# EAGLE design dimmer230 (EAGLE 4.16)
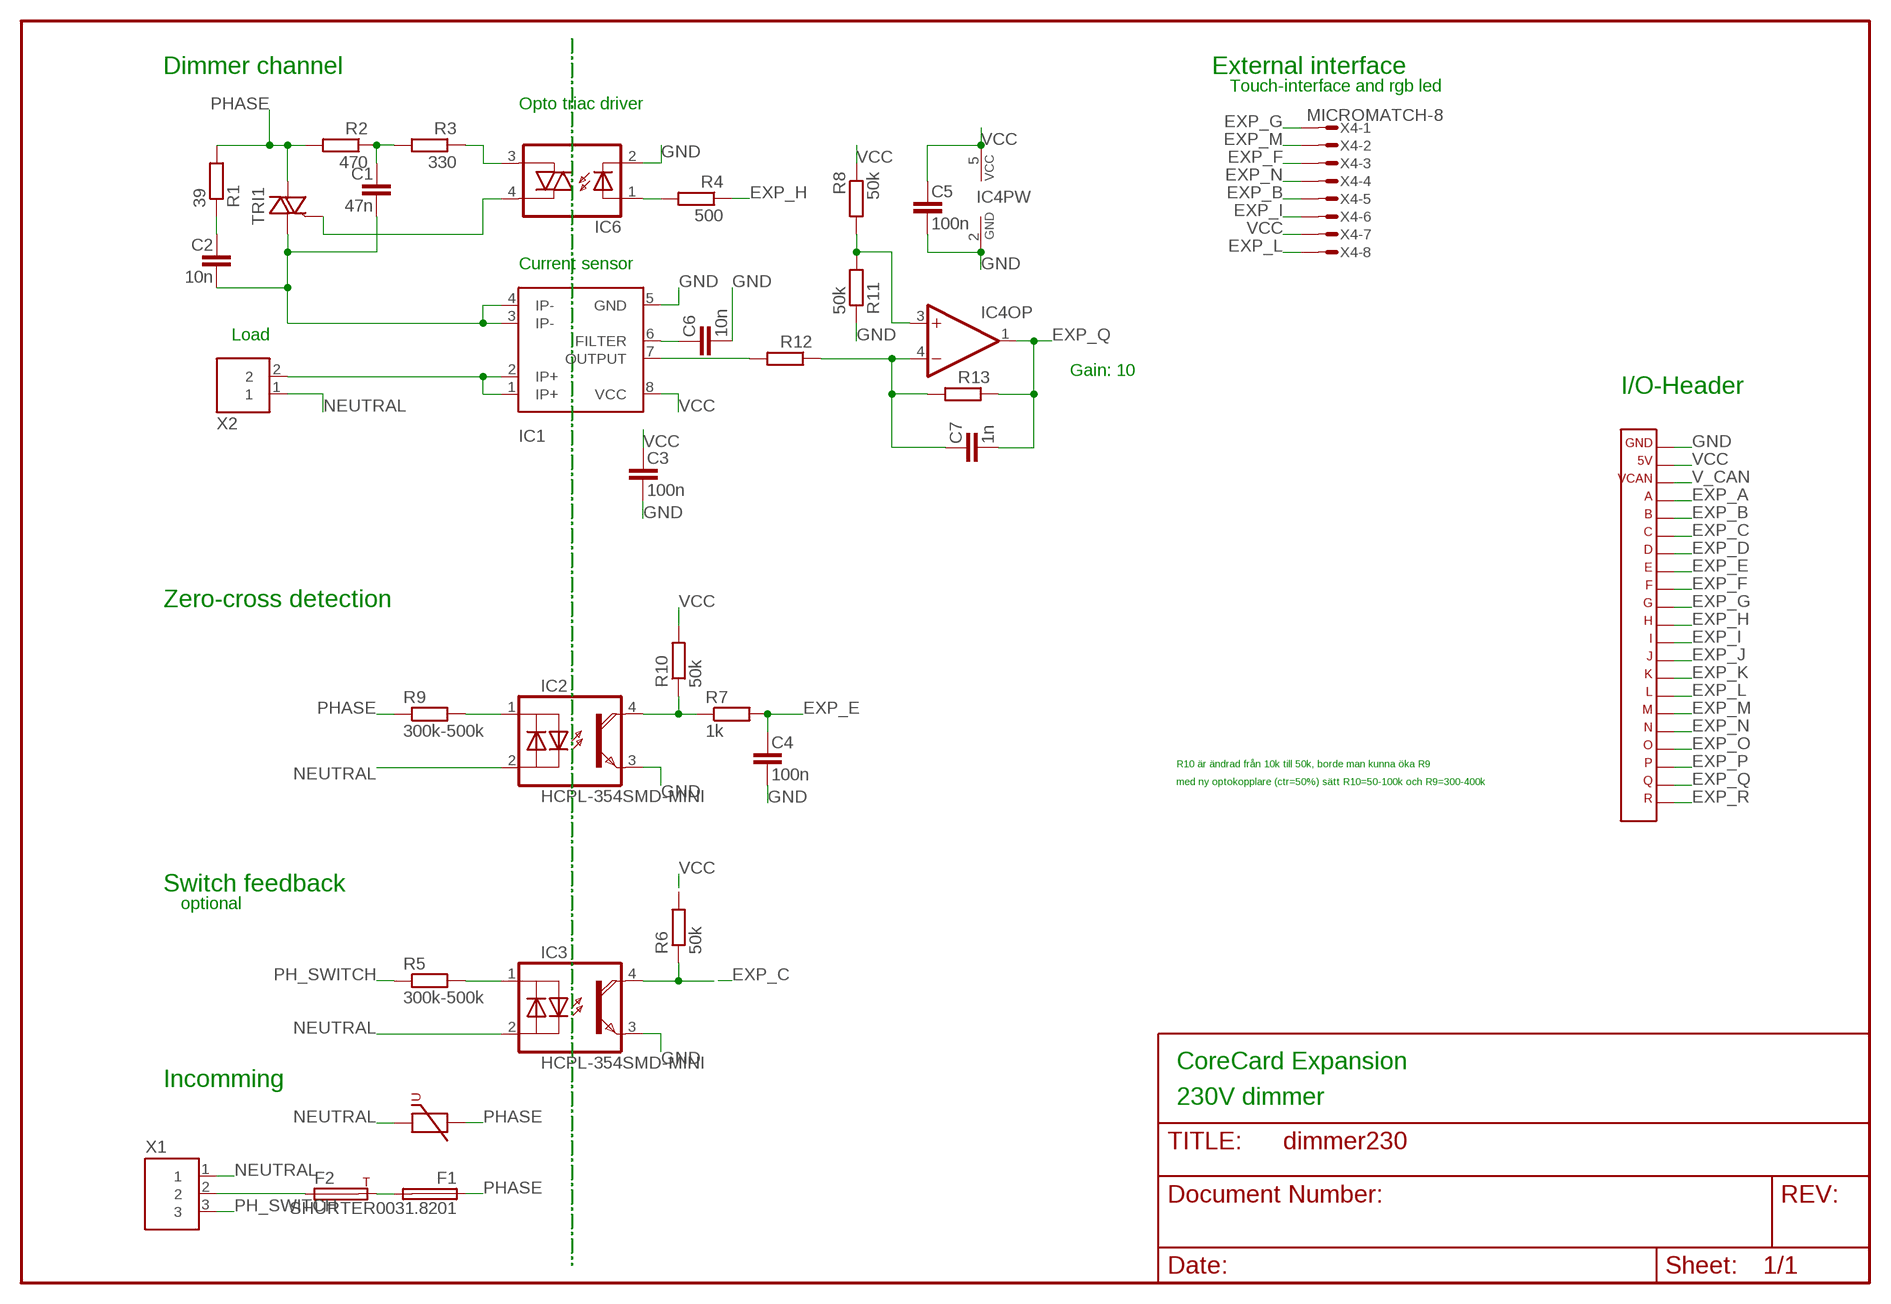
[diagram p0: schematic, sheet 1]

## Parts
C1  47n  C-EUC102-04313  [C102-04313]
C2  10n  C-EUC102-04313  [C102-04313]
C3  100n  C-EUC0603  [C0603]
C4  100n  C-EUC0603  [C0603]
C5  100n  C-EUC0603  [C0603]
C6  10n  C-EUC0603  [C0603]
C7  1n  C-EUC0603  [C0603]
F1  SHURTER0031.8201  [22.5]
F2  G4APHT  [PHT]
IC1  ACS712SOIC  [SOIC]
IC2  HCPL-354SMD-MINI  [SMD-MINI]
IC3  HCPL-354SMD-MINI  [SMD-MINI]
IC4  NCS2001SQ2T2SOT23-5  [SOT23-5]
IC6  S2S3ADYFSMD  [SMD]
R1  39  R-EUR1206  [R1206]
R2  470  R-EUR1206  [R1206]
R3  330  R-EUR1206  [R1206]
R4  500  R-EUR0603  [R0603]
R5  300k-500k  R-EUR1206  [R1206]
R6  50k  R-EUR0603  [R0603]
R7  1k  R-EUR0603  [R0603]
R8  50k  R-EUR0603  [R0603]
R9  300k-500k  R-EUR1206  [R1206]
R10  50k  R-EUR0603  [R0603]
R11  50k  R-EUR0603  [R0603]
R12  R-EUR0603  [R0603]
R13  R-EUR0603  [R0603]
TRI1  BTA204SDPAK  [DPAK]
V1  VC32SMD  [SMD]
X1  BLOCK35.08  [PCB3_5.08]
X2  BLOCK25.08  [PCB2_5.08]
X3  CORE_IOHEADEXP  [CORE_IOHEAD_NOSILC]
X4  MICROMATCH-8  [MICROMATCH-8]

## Nets
CUR_DIV: IC4.3(OP:+IN) R8.2 R11.2
CUR_OUTP: IC1.7(OUTPUT) R12.2
EXP_A: X3.4
EXP_B: X3.5 X4.5
EXP_C: IC3.4(COL) R6.1 X3.6
EXP_D: X3.7
EXP_E: C4.1 R7.2 X3.8
EXP_F: X3.9 X4.3
EXP_G: X3.10 X4.1
EXP_H: R4.1 X3.11
EXP_I: X3.12 X4.6
EXP_J: X3.13
EXP_K: X3.14
EXP_L: X3.15 X4.8
EXP_M: X3.16 X4.2
EXP_N: X3.17 X4.4
EXP_O: X3.18
EXP_P: X3.19
EXP_Q: C7.2 IC4.1(OP:OUT) R13.1 X3.20
EXP_R: X3.21
FILT: C6.1 IC1.6(FILTER)
GATE1: IC6.4(A2) TRI1.3(G)
GND: C3.2 C4.2 C5.2 C6.2 IC1.5(GND) IC2.3(E) IC3.3(E) IC4.2(PW:GND) IC6.2(C) R11.1 X3.1
IP+: IC1.1(IP+) IC1.2(IP+) X2.2
IP-: C1.2 C2.2 IC1.3(IP-) IC1.4(IP-) TRI1.1(T1)
N$1: IC6.3(A1) R3.1
N$2: C1.1 R2.1 R3.2
N$3: IC2.1(A) R9.2
N$4: IC6.1(A) R4.2
N$5: IC2.4(COL) R7.1 R10.1
N$7: C2.1 R1.1
N$9: IC3.1(A) R5.2
NEUTRAL: IC2.2(C) IC3.2(C) V1.P$1 X1.1 X2.1
OP_NEG: C7.1 IC4.4(OP:-IN) R12.1 R13.2
PH_SWITCH: R5.1 X1.3
PHASE: F1.P$1 R1.2 R2.2 R9.1 TRI1.MB(T2) V1.P$2
THERMAL_FUSED: F1.P$2 F2.P$2
UNFUSED_PHASE: F2.P$1 X1.2
V_CAN: X3.3
VCC: C3.1 C5.1 IC1.8(VCC) IC4.5(PW:VCC) R6.2 R8.1 R10.2 X3.2 X4.7

## Notes on the sheet
- Dimmer channel | External interface
- Touch-interface and rgb led
- Opto triac driver
- Current sensor
- Load
- Gain: 10
- I/O-Header
- Zero-cross detection
- R10 är ändrad från 10k till 50k, borde man kunna öka R9
- med ny optokopplare (ctr=50%) sätt R10=50-100k och R9=300-400k
- Switch feedback
- optional
- CoreCard Expansion
- Incomming
- 230V dimmer

## Library data of the parts
C1-C7 = rcl:C-EU
F1 = fuseholder_schurter:SHURTER0031.8201
F2 = thermofuse-g4a:G4A
IC1 = ACS712:ACS712
IC2 IC3 = optocoupler_hcpl-354:HCPL-354
IC4 = NCS2001:NCS2001SQ2T2
IC6 = optocoupler-S2S3ADYF:S2S3ADYF
R1-R13 = rcl:R-EU
TRI1 = triac:BTA204S
V1 = varistor_VC32:VC32
X1 = terminal_block:BLOCK3
X2 = terminal_block:BLOCK2
X3 = expboard:CORE_IOHEAD: CoreCard IO-header for expansion cards
X4 = con-amp-micromatch:MICROMATCH-8: MicroMaTch 8 7-215464-8 / 0-215464-8 Drawing Number C-215464 DDEController.pdf

## Board
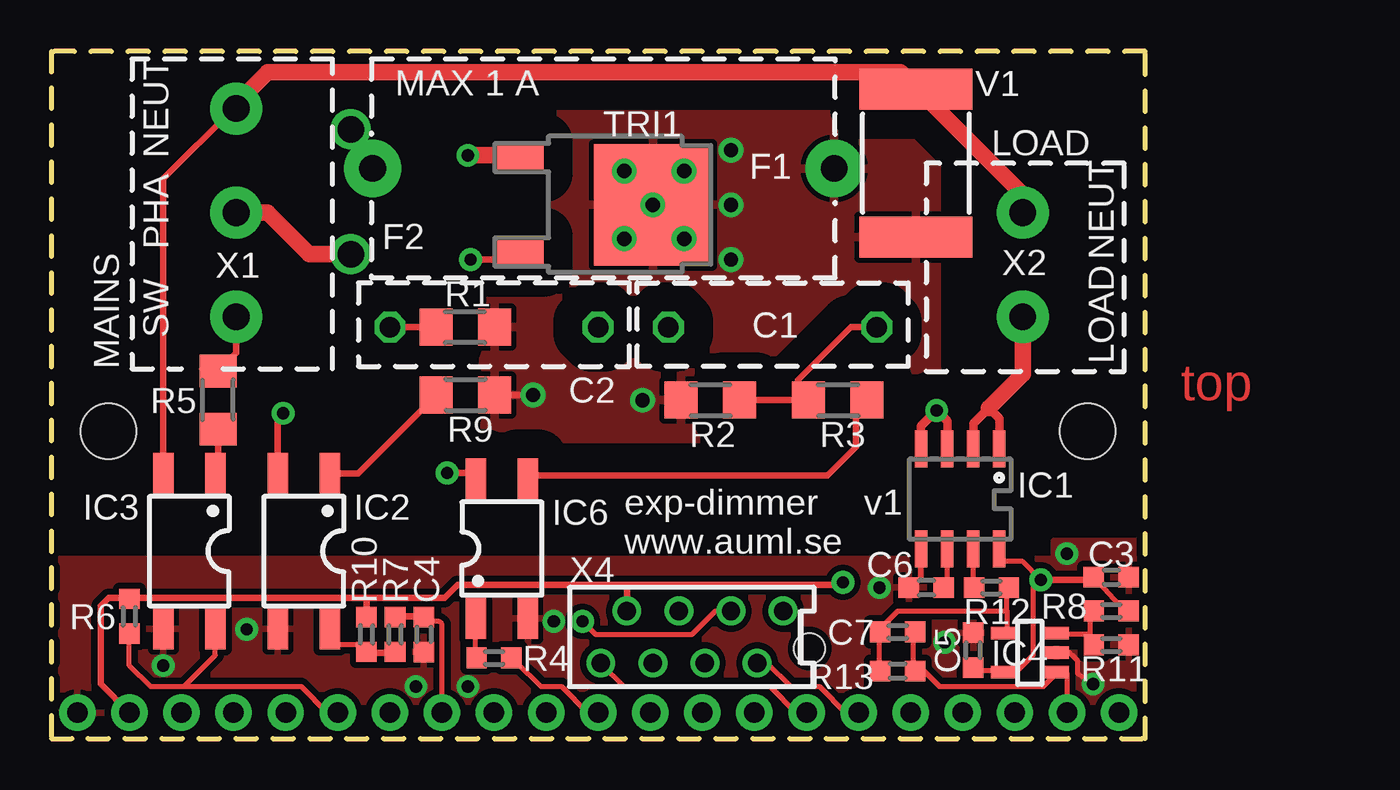
[diagram p1: board, top side]
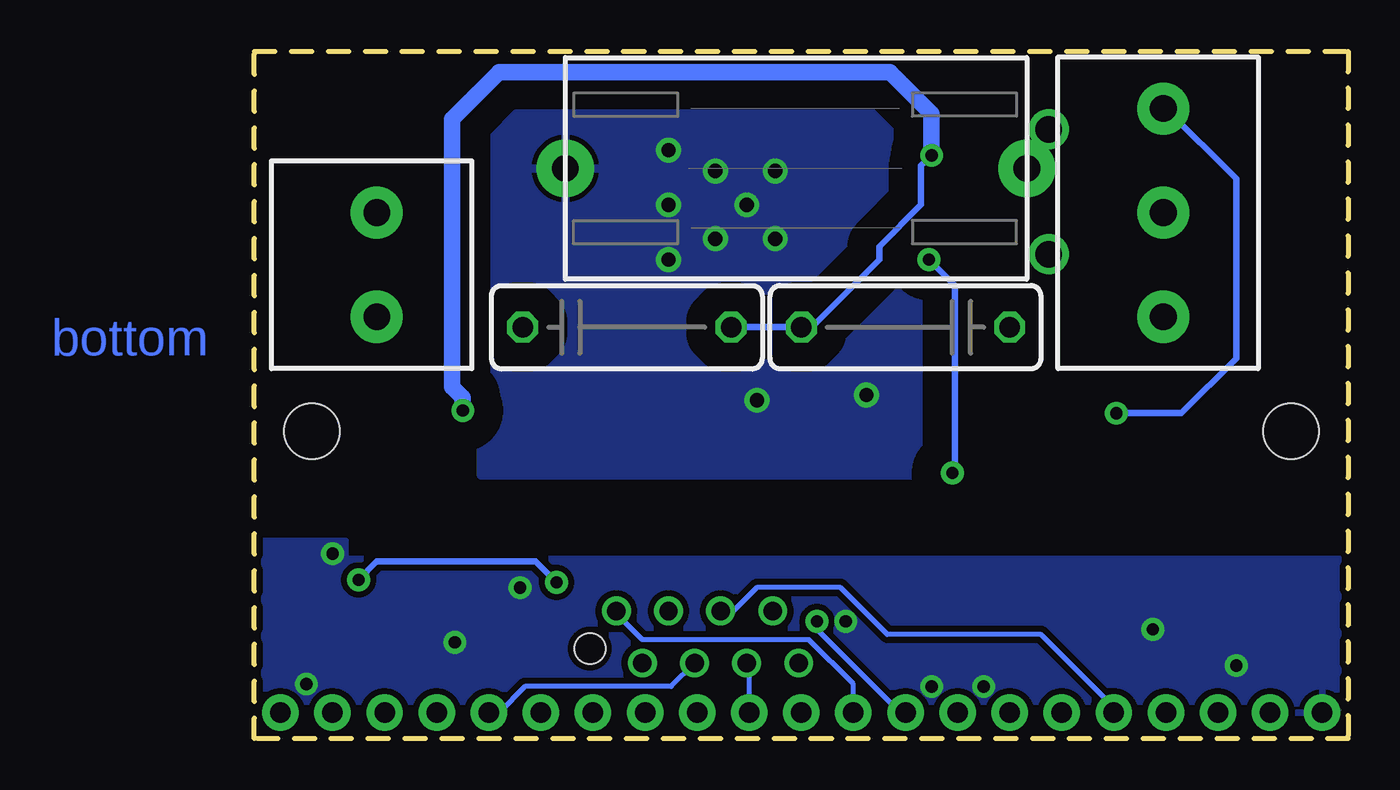
[diagram p2: board, bottom side, seen from below]

Size 53.34 x 33.53 mm. Coordinates in mm from the lower left corner, seen from the top.
Outline: 0,0 53.34,0 53.34,33.53 0,33.53 0,0
Copper layers (1*16): Top 0.035mm / dielectric 1.5mm / Bottom 0.035mm
Design rules "default": minimum track width 10mil, minimum drill 0.6mm, track to track 10mil, track to pad 10mil, pad to pad 10mil, via to via 10mil, smd to smd 8mil, copper to edge 10mil, drill to drill 8mil, minimum pad ring 10mil, minimum via ring 10mil, stop-mask expansion 4mil, vias tented up to drill 0mil, thermal gap 10mil
Holes 2.7 mm at 50.55,14.99 2.79,14.99

### Footprints (pad centres in the part's own frame; a part is rotated, then mirrored left to right if it is on the bottom)
C102-04313 = drill 1 octagon: 1 -5.08,0; 2 5.08,0
C0603 = smd 1 x 1: 1 -0.85,0; 2 0.85,0
22.5 = drill 1.3 pad 2.794 round: P$1 11.25,0; P$2 -11.25,0
PHT = drill 1.3 round: P$1 0,-3.048; P$2 0,3.048
SOIC = smd 0.6 x 1.8: 1 -1.905,-2.44; 2 -0.635,-2.44; 3 0.635,-2.44; 4 1.905,-2.44; 5 1.905,2.44; 6 0.635,2.44; 7 -0.635,2.44; 8 -1.905,2.44
SMD-MINI = smd 1 x 2: 1 -2.54,-3.795; 2 0,-3.795; 3 0,3.795; 4 -2.54,3.795
SOT23-5 = smd 0.6 x 1.2: 1 -0.95,-0.636; 2 0,-0.636; 3 0.95,-0.636; 4 0.95,1.976; 5 -0.95,1.976
SMD = smd 1 x 2: 1 -1.016,-3.395; 2 1.524,-3.395; 3 1.524,3.395; 4 -1.016,3.395
R1206@1 = smd 1.6 x 1.803: 1 -1.422,0; 2 1.422,0
R0603@1 = smd 0.991 x 1.016: 1 -0.85,0; 2 0.85,0
R1206 = smd 1.6 x 1.803: 1 -1.422,0; 2 1.422,0
R0603 = smd 0.991 x 1.016: 1 -0.85,0; 2 0.85,0
DPAK = smd 1.5 x 2.4: 1 -2.3,-1.2; 3 2.3,-1.2 | smd 5.9 x 5.75: MB 0,5.35
SMD' = smd 5.5 x 2: P$1 0,-3.6; P$2 0,3.6
PCB3_5.08 = drill 1.3 pad 2.54 round: 1 -5.08,0; 2 0,0; 3 5.08,0
PCB2_5.08 = drill 1.3 pad 2.54 round: 1 -2.54,0; 2 2.54,0
CORE_IOHEAD_NOSILC = drill 1 pad 1.778 round: 1 25.4,0; 2 22.86,0; 3 20.32,0; 4 17.78,0; 5 15.24,0; 6 12.7,0; 7 10.16,0; 8 7.62,0; 9 5.08,0; 10 2.54,0; 11 0,0; 12 -2.54,0; 13 -5.08,0; 14 -7.62,0; 15 -10.16,0; 16 -12.7,0; 17 -15.24,0; 18 -17.78,0; 19 -20.32,0; 20 -22.86,0; 21 -25.4,0
MICROMATCH-8 = drill 0.9 round: 1 4.445,1.27; 2 3.175,-1.27; 3 1.905,1.27; 4 0.635,-1.27; 5 -0.635,1.27; 6 -1.905,-1.27; 7 -3.175,1.27; 8 -4.445,-1.27 | hole 1.5: 5.739,-0.562

### Placement (x,y rotation side)
C1  35.18,20.07 0 bottom
C2  21.59,20.07 180 bottom
C3  51.69,7.87 0 top
C4  18.16,5.08 270 top
C5  44.96,4.32 90 top
C6  42.67,7.37 180 top
C7  41.27,3.3 0 top
F1  26.92,27.81 180 bottom
F2  14.61,26.67 0 top
IC1  44.32,11.68 180 top
IC2  11.05,9.14 180 top
IC3  5.46,9.14 180 top
IC4  48.39,4.19 90 top
IC6  21.72,9.27 0 top
R1  39  [R1206@1]  20.19,20.07 0 top
R2  470  [R1206@1]  32.13,16.51 180 top
R3  330  [R1206@1]  38.35,16.51 180 top
R4  500  [R0603@1]  21.59,3.94 180 top
R5  8.13,16.51 270 top
R6  3.81,5.97 90 top
R7  16.76,5.08 90 top
R8  51.69,6.22 180 top
R9  20.19,16.76 180 top
R10  15.37,5.08 90 top
R11  51.69,4.57 180 top
R12  45.85,7.37 180 top
R13  41.27,5.21 180 top
TRI1  24,26.04 270 top
V1  [SMD']  42.16,28.07 180 top
X1  9.02,25.65 270 bottom
X2  47.37,23.11 270 bottom
X3  26.67,1.27 0 bottom
X4  31.24,4.95 0 top

### Tracks (layer width: path | path; a pad name or v marks a point on that pad's centre or on a via)
CUR_DIV
  Top 0.254: R8.2 50.71,6.1 50.67,6.1 50.67,4.45 R11.2 50.59,5.08 49.15,5.08 IC4.3
CUR_OUTP
  Top 0.254: R12.2 45,7.45 44.96,7.49 IC1.7 44.96,9.27
EXP_B
  Bottom 0.254: X4.5 29.97,6.22 28.83,7.37 24.77,7.37 22.48,5.08 14.99,5.08 11.43,1.52 X3.5
EXP_C
  Top 0.254: R6.1 3.81,3.56 4.83,2.54 6.48,2.54 | 6.48,2.54 8,4.06 IC3.4 | X3.6 13.46,1.27 12.19,2.54 6.48,2.54
EXP_E
  Top 0.254: 18.16,5.97 C4.1 18.29,5.8 18.29,5.71 18.92,5.71 19.05,5.59 X3.8
  Top 0.305: R7.2 17.11,5.93 17.14,5.97 18.16,5.97
EXP_F  (via drill 0.6)
  Top 0.254: X4.3 32.38,6.22 31.24,5.08 26.54,5.08 v25.91,5.71
  Bottom 0.254: v25.91,5.71 25.91,5.33 21.84,1.27 X3.9
EXP_G
  Bottom 0.254: X4.1 35.69,6.1 34.42,4.83 26.29,4.83 24.13,2.67 X3.10
EXP_H
  Top 0.254: R4.1 22.69,3.77 22.69,3.72 23.88,2.54 24.89,2.54 26.16,1.27 X3.11
EXP_I
  Bottom 0.254: X4.6 29.21,3.56 X3.12
EXP_L
  Top 0.254: X4.8 27.94,2.54 35.05,2.54 36.32,1.27 X3.15
EXP_M
  Top 0.254: X4.2 34.92,3.68 36.07,2.54 37.47,2.54 38.73,1.27 X3.16
EXP_N
  Bottom 0.254: X4.4 33.02,2.54 40.13,2.54 41.4,1.27 X3.17
EXP_Q
  Top 0.254: 49.15,3.17 | IC4.1 49.15,3.17 | X3.20 49.53,3.17 49.15,3.17 | IC4.1 49.15,3.3 | C7.2 42.55,3.3 | 42.55,3.3 42.04,3.43 42.04,4.95 42.16,5.08 R13.1 | 42.55,3.3 43.31,2.54 48.39,2.54 49.02,3.18 IC4.1
FILT
  Top 0.254: C6.1 43.56,7.37 43.69,7.49 IC1.6 43.69,9.27
GATE1  (via drill 0.6)
  Top 0.305: 22.86,23.75 22.85,23.73 TRI1.3 22.86,23.73 22.86,23.75 | 22.86,23.75 23.24,23.37 | v20.45,23.37 22.86,23.37 22.86,23.75 | IC6.4 20.7,12.7 20.45,12.95 v19.3,12.95
  Bottom 0.305: v20.45,23.37 19.18,22.1 19.18,13.08 v19.3,12.95
GND  (via drill 0.6)
  Top 0.254: IC4.2 49.66,4.19 49.78,4.06 50.04,3.81 50.04,3.17 v50.8,2.67 | C6.2 41.91,7.37 42.42,7.87 IC1.5 42.42,9.27
  other vias: 5.46,3.56 17.78,2.54 9.53,5.33 40.39,7.37 49.53,9.02 43.56,4.7 20.32,2.54 24.51,5.71
  pour Bottom (isolate 0.305, rank 3): 0,8.76 48.9,8.76 48.9,9.65 53.34,9.65 53.34,1.14 0,1.14
  pour Top (isolate 0.305, rank 3): 0,8.76 48.9,8.76 48.9,9.65 53.34,9.65 53.34,1.14 0,1.14
IP+
  Top 0.406: IC1.1 46.23,15.62 45.72,16.13 44.96,15.37 IC1.2
  Top 0.813: X2.2 47.37,17.78 45.72,16.13
IP-  (via drill 0.6)
  Top 0.305: 22.73,28.32 22.61,28.19
  Top 0.406: IC1.3 43.69,15.49 v43.18,16 42.42,15.24 IC1.4
  Top 0.813: 22.59,28.46 22.73,28.32 22.75,28.34 TRI1.1 22.8,28.38 22.73,28.45 v20.32,28.45
  Bottom 0.305: C1.2 C2.2 26.16,20.07 22.86,23.37 22.86,24 20.83,26.04 20.83,27.94 v20.32,28.45
  Bottom 0.813: v43.18,16 43.18,16.64 43.69,17.14 43.69,30.23 41.4,32.51 22.35,32.51 20.32,30.48 v20.32,28.45
N$1
  Top 0.305: R3.1 39.12,16.51 39.24,16.38 39.24,14.22 37.85,12.83 23.37,12.83 23.24,12.7 IC6.3
N$2
  Top 0.305: R3.2 36.2,16.51 | R2.1 R3.2 | R3.2 36.42,16.87 36.42,17.5 38.99,20.07 C1.1
N$3
  Top 0.305: R9.2 18.77,16.66 18.8,16.64 18.8,16.76 14.97,12.94 IC2.1
N$4
  Top 0.254: R4.2 20.7,4.06 IC6.1
N$5
  Top 0.254: 15.62,4.19 R10.1 15.37,4.19 14.99,4.57 13.97,4.57 13.59,4.95 IC2.4 | 15.75,4.1 15.37,4.06 15.49,4.19 15.46,4.23 15.41,4.23
  Top 0.305: 15.37,4.19 15.41,4.23 R10.1 | R7.1 16.93,4.23 16.89,4.19 15.49,4.19
N$7
  Top 0.305: C2.1 R1.1
N$9
  Top 0.305: IC3.1 8,13.08 8.13,13.08 R5.2 8.13,15.11
NEUTRAL  (via drill 0.6)
  Top 0.305: X1.1 8.89,30.73 5.46,27.3 IC3.2 | IC2.2 11.05,15.62 v11.3,15.88
  Top 0.813: X1.1 8.64,30.61 10.54,32.51 41.4,32.51 | 41.4,32.51 47.37,26.54 X2.1 | 41.4,32.51 V1.P$1
  Bottom 0.305: v11.3,15.88 8.13,15.88 5.46,18.54 5.46,27.3 8.89,30.73 X1.1
OP_NEG
  Top 0.254: C7.1 40.42,3.39 40.39,3.43 40.39,5.08 R13.2 40.42,5.29 40.39,5.33 41.27,6.22 46.48,6.22 46.61,6.22 | 46.61,7.37 R12.1 46.7,7.33 46.61,7.24 46.61,6.22 | 46.54,5.14 46.61,5.21 46.61,6.22 | 46.54,5.14 IC4.4 | 46.54,5.14 46.67,5.02
PH_SWITCH
  Top 0.305: 7.37,18.03 R5.1 9.02,18.8 X1.3
PHASE  (via drill 0.7)
  Top 0.305: R9.1 v23.5,16.76
  other vias: 27.94,27.69 30.86,27.69 27.94,24.38 29.34,26.04 30.86,24.38 28.83,16.51 33.15,28.7 33.15,26.04 33.15,23.37
  pour Bottom (isolate 1.422, rank 3): 17.4,33.4 17.4,12.83 42.29,12.83 42.29,33.4
  pour Top (isolate 1.422, rank 3): 17.4,33.27 17.4,14.22 43.18,14.22 43.18,33.27
THERMAL_FUSED
  Top 0.813: F2.P$2 14.61,29.46 15.67,28.39 F1.P$2
UNFUSED_PHASE
  Top 0.813: X1.2 10.54,25.65 12.57,23.62 F2.P$1
VCC  (via drill 0.6)
  Top 0.254: R6.2 3.9,6.82 3.94,6.86 | 50.8,7.91 50.8,7.87 51.05,7.62 52.32,6.22 R8.1 52.45,6.1 | C5.1 44.96,3.3 46.48,3.3 | 46.48,3.3 46.54,3.25 IC4.5 | 46.48,3.3 47.12,3.3 47.88,4.06 47.88,7.37 v48.26,7.75 47.37,8.64 46.35,8.64 46.23,8.76 IC1.8
  Top 0.305: X3.2 2.41,2.67 2.41,6.48 2.79,6.86 3.94,6.86 15.37,6.86 | 15.37,6.86 R10.2 | 15.37,6.86 19.18,6.86 19.81,7.49 28.07,7.49 | 28.07,7.49 38.48,7.49 v38.61,7.62 | C3.1 50.8,7.91 50.67,7.75 v48.26,7.75 | 28.07,7.49 X4.7
  Bottom 0.305: v38.61,7.62 39.62,8.64 47.37,8.64 v48.26,7.75

### Text on the board
Top: top
Bottom: bottom
tPlace: MAX 1 A | NEUT | LOAD | PHA | NEUT | SW | MAINS | LOAD | exp-dimmer | v1 | www.auml.se
tStop: top
bStop: bottom
Document: Edge of | CoreCard | Top is component side | Expansion will be mounted bottom to bottom with CoreCard